# EAGLE design Juggling_Egg_V01 (EAGLE 9.7.0)
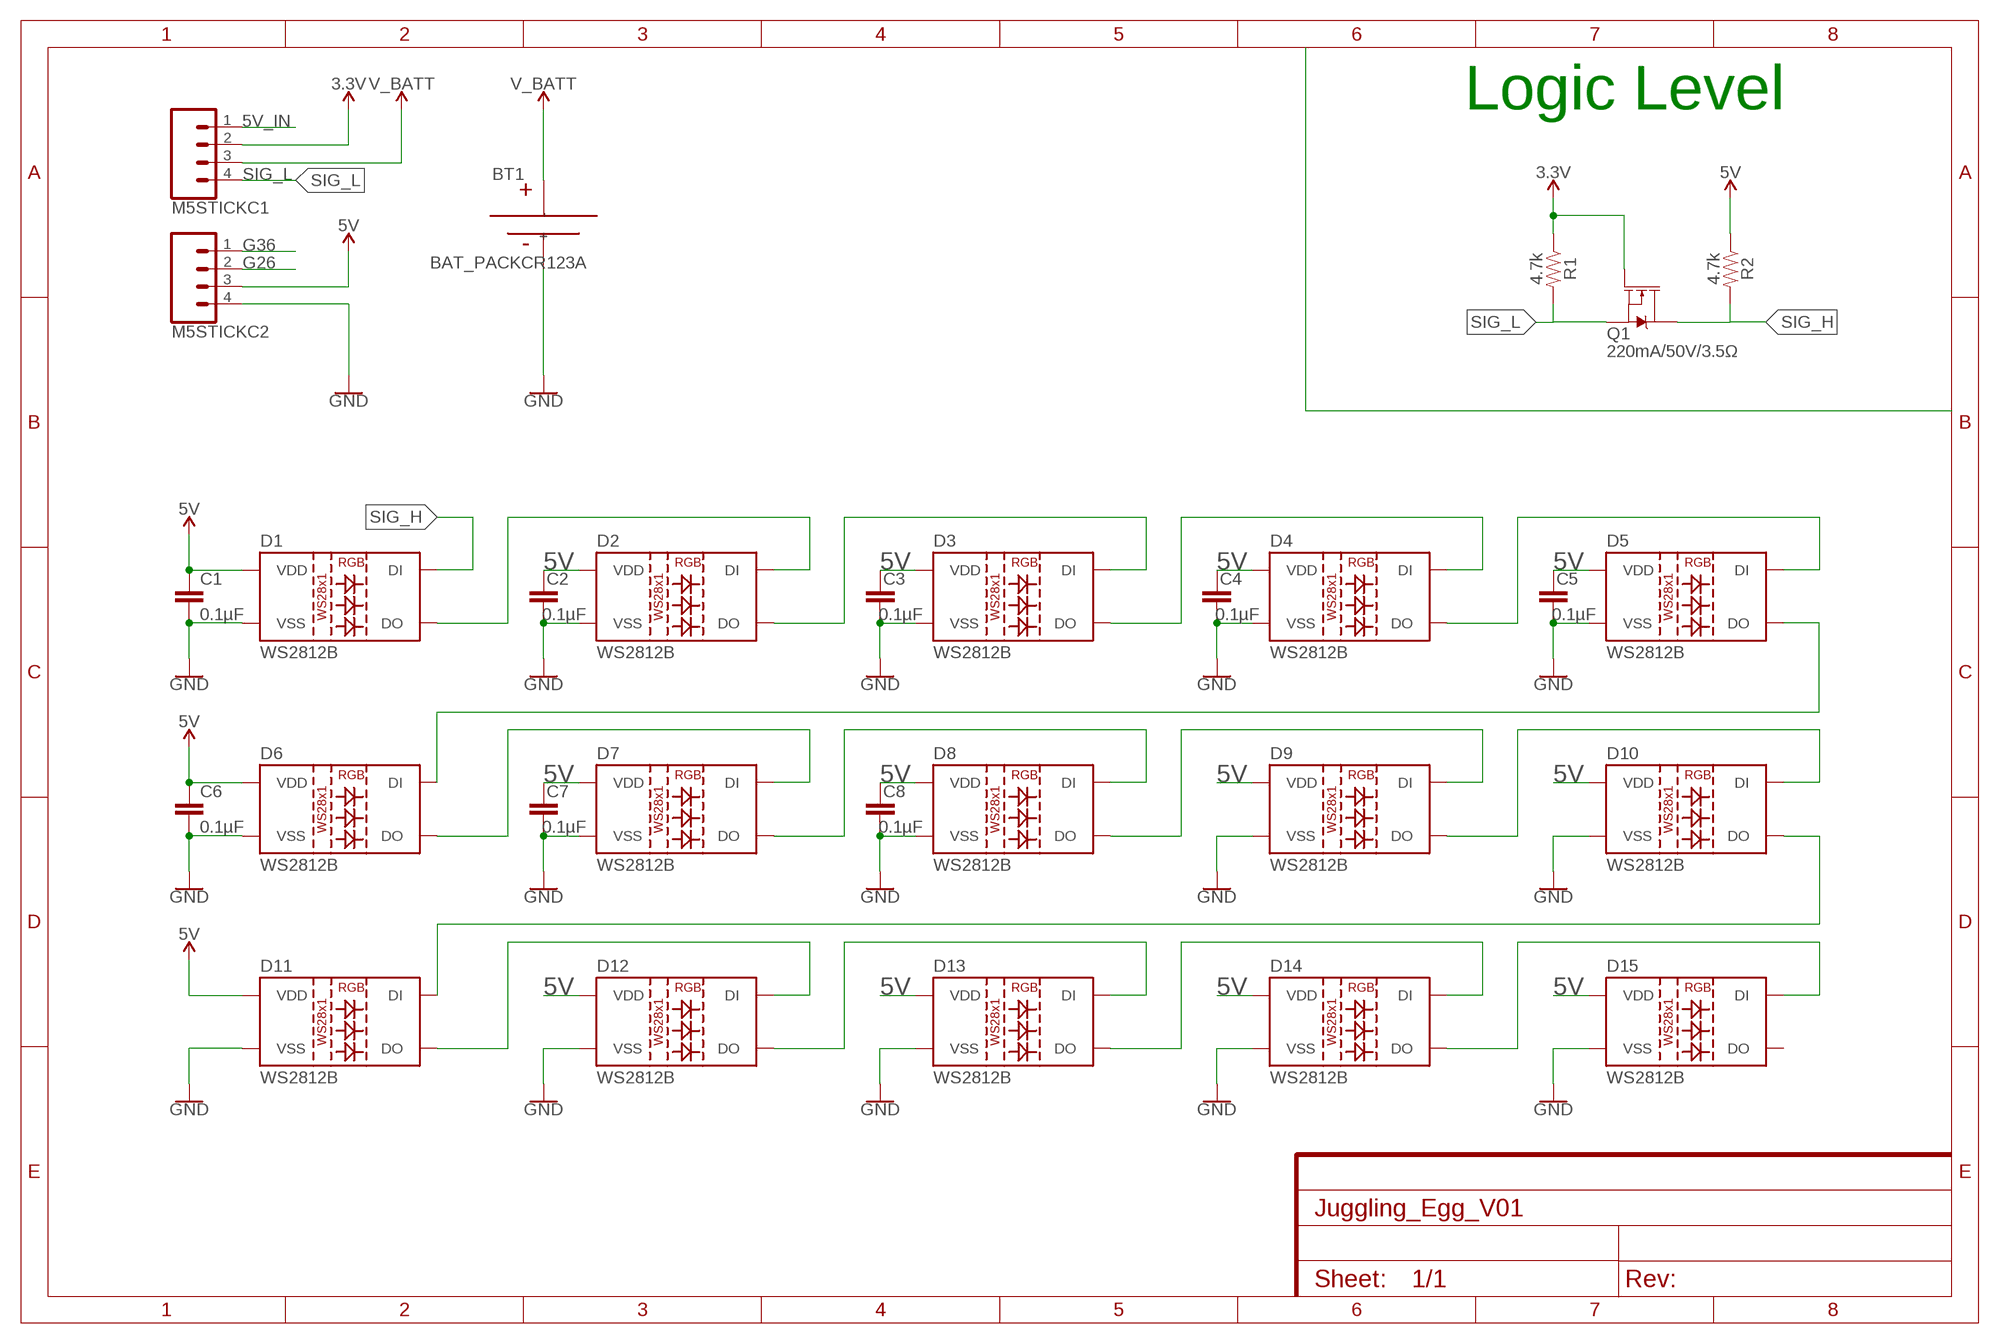
[diagram p0: schematic, sheet 1]

## Parts
BT1  BAT_PACKCR123A  [BH123A]
C1  0.1µF  0.33UF/330NF-0805-50V-10%  [0805]
C2  0.1µF  0.33UF/330NF-0805-50V-10%  [0805]
C3  0.1µF  0.33UF/330NF-0805-50V-10%  [0805]
C4  0.1µF  0.33UF/330NF-0805-50V-10%  [0805]
C5  0.1µF  0.33UF/330NF-0805-50V-10%  [0805]
C6  0.1µF  0.33UF/330NF-0805-50V-10%  [0805]
C7  0.1µF  0.33UF/330NF-0805-50V-10%  [0805]
C8  0.1µF  0.33UF/330NF-0805-50V-10%  [0805]
D1  WS2812B  [WS2812B]
D2  WS2812B  [WS2812B]
D3  WS2812B  [WS2812B]
D4  WS2812B  [WS2812B]
D5  WS2812B  [WS2812B]
D6  WS2812B  [WS2812B]
D7  WS2812B  [WS2812B]
D8  WS2812B  [WS2812B]
D9  WS2812B  [WS2812B]
D10  WS2812B  [WS2812B]
D11  WS2812B  [WS2812B]
D12  WS2812B  [WS2812B]
D13  WS2812B  [WS2812B]
D14  WS2812B  [WS2812B]
D15  WS2812B  [WS2812B]
M5STICKC1  CONN_04SMD  [1X04_SMD_RA_MALE]
M5STICKC2  CONN_04SMD  [1X04_SMD_RA_MALE]
Q1  220mA/50V/3.5Ω  MOSFET-NCH-BSS138  [SOT23-3]
R1  4.7k  RESISTOR0805  [0805]
R2  4.7k  RESISTOR0805  [0805]

## Nets
3.3V: M5STICKC1.2 Q1.1(G) R1.1
5V: C1.1 C2.2 C3.2 C4.2 C5.2 C6.1 C7.2 C8.2 D1.1(VDD) D2.1(VDD) D3.1(VDD) D4.1(VDD) D5.1(VDD) D6.1(VDD) D7.1(VDD) D8.1(VDD) D9.1(VDD) D10.1(VDD) D11.1(VDD) D12.1(VDD) D13.1(VDD) D14.1(VDD) D15.1(VDD) M5STICKC2.3 R2.1
5V_IN: M5STICKC1.1
G26: M5STICKC2.2
G36: M5STICKC2.1
GND: BT1.- C1.2 C2.1 C3.1 C4.1 C5.1 C6.2 C7.1 C8.1 D1.3(VSS) D2.3(VSS) D3.3(VSS) D4.3(VSS) D5.3(VSS) D6.3(VSS) D7.3(VSS) D8.3(VSS) D9.3(VSS) D10.3(VSS) D11.3(VSS) D12.3(VSS) D13.3(VSS) D14.3(VSS) D15.3(VSS) M5STICKC2.4
N$2: D2.2(DO) D3.4(DI)
N$3: D3.2(DO) D4.4(DI)
N$4: D4.2(DO) D5.4(DI)
N$5: D6.2(DO) D7.4(DI)
N$6: D1.2(DO) D2.4(DI)
N$7: D7.2(DO) D8.4(DI)
N$8: D8.2(DO) D9.4(DI)
N$9: D9.2(DO) D10.4(DI)
N$10: D11.2(DO) D12.4(DI)
N$11: D12.2(DO) D13.4(DI)
N$12: D13.2(DO) D14.4(DI)
N$13: D14.2(DO) D15.4(DI)
N$14: D5.2(DO) D6.4(DI)
N$15: D10.2(DO) D11.4(DI)
SIG_H: D1.4(DI) Q1.3(D) R2.2
SIG_L: M5STICKC1.4 Q1.2(S) R1.2
V_BATT: BT1.+ M5STICKC1.3
Unconnected: D15.2(DO)

## Notes on the sheet
- Logic Level

## Library data of the parts
BT1 = batteries:BAT_PACK: collection of battery footprints; DIGIKEY: BH123A-ND; MANUFACTURER: MPD; MPN: BH123A
C1-C8 = SparkFun-Capacitors:0.33UF/330NF: 0.33µF/330nF ceramic capacitors A capacitor is a passive two-terminal electrical component used to store electrical energy temporarily in an electric field.; PROD_ID: CAP-08469; VALUE: 0.33µF
D1-D15 = SparkFun-LED:WS2812B: WS2812B SMD addressable RGB LED 5x5mm SMD LED with built-in controller IC. Color: Red/Green/Blue mC Rating: RGB: 390, 660, 180 mcd Forward Voltage: RGB: 2.0, 3.0, 3.0 V Packages:WS2812B SparkFun Products: Blynk Board - ESP8266 <https://www.sparkfun.com/products/13794>; PROD_ID: DIO-12503
M5STICKC1 M5STICKC2 = SparkFun-Connectors:CONN_04: Multi connection point. Often used as Generic Header-pin footprint for 0.1 inch spaced/style header connections On any of the 0.1 inch spaced packages, you can populate with these: Break Away Headers - Straight <https://www.sparkfun.com/products/116> (PRT-00116) Break Away Male Headers - Right Angle <https://www.sparkfun.com/products/553> (PRT-00553) Female Headers <https://www.sparkfun.com/products/115> (PRT-00115) Break Away Headers - Machine Pin <https://www.sparkfun.com/products/117> (PRT-00117) Break Away Female Headers - Swiss Machine Pin <https://www.sparkfun.com/products/743> (PRT-00743) For SCREWTERMINALS and SPRING TERMINALS visit here: Screw Terimnals on SparkFun.com <https://www.sparkfun.com/search/results?term=Screw+Terminals> (5mm/3.5mm/2.54mm spacing) This device is also useful as a general connection point to wire up your design to another part of your project. Our various solder wires solder well into these plated through hole pads. Hook-Up Wire - Assortment (Stranded, 22 AWG) <https://www.sparkfun.com/products/11375> (PRT-11375) Hook-Up Wire - Assortment (Solid Core, 22 AWG) <https://www.sparkfun.com/products/11367> (PRT-11367) View the entire wire category on our website here <https://www.sparkfun.com/categories/141> Special notes: Molex polarized connector foot print use with SKU : PRT-08231 with associated crimp pins and housings. 1MM SMD Version SKU: PRT-10208; PROD_ID: CONN-09140; SF_ID: PRT-12638
Q1 = SparkFun-DiscreteSemi:MOSFET-NCH: N-channel MOSFETs Voltage controlled devices that allow control of high current outputs. SparkFun Products: SparkFun OpenScale <https://www.sparkfun.com/products/13261> SparkFun Digital Sandbox <https://www.sparkfun.com/products/12651> SparkFun Monster Moto Shield <https://www.sparkfun.com/products/10182> SparkFun MOSFET Power Controller <https://www.sparkfun.com/products/11214>; PROD_ID: TRANS-00830
R1 R2 = SparkFun-Resistors:RESISTOR: Generic Resistor Package

## Board
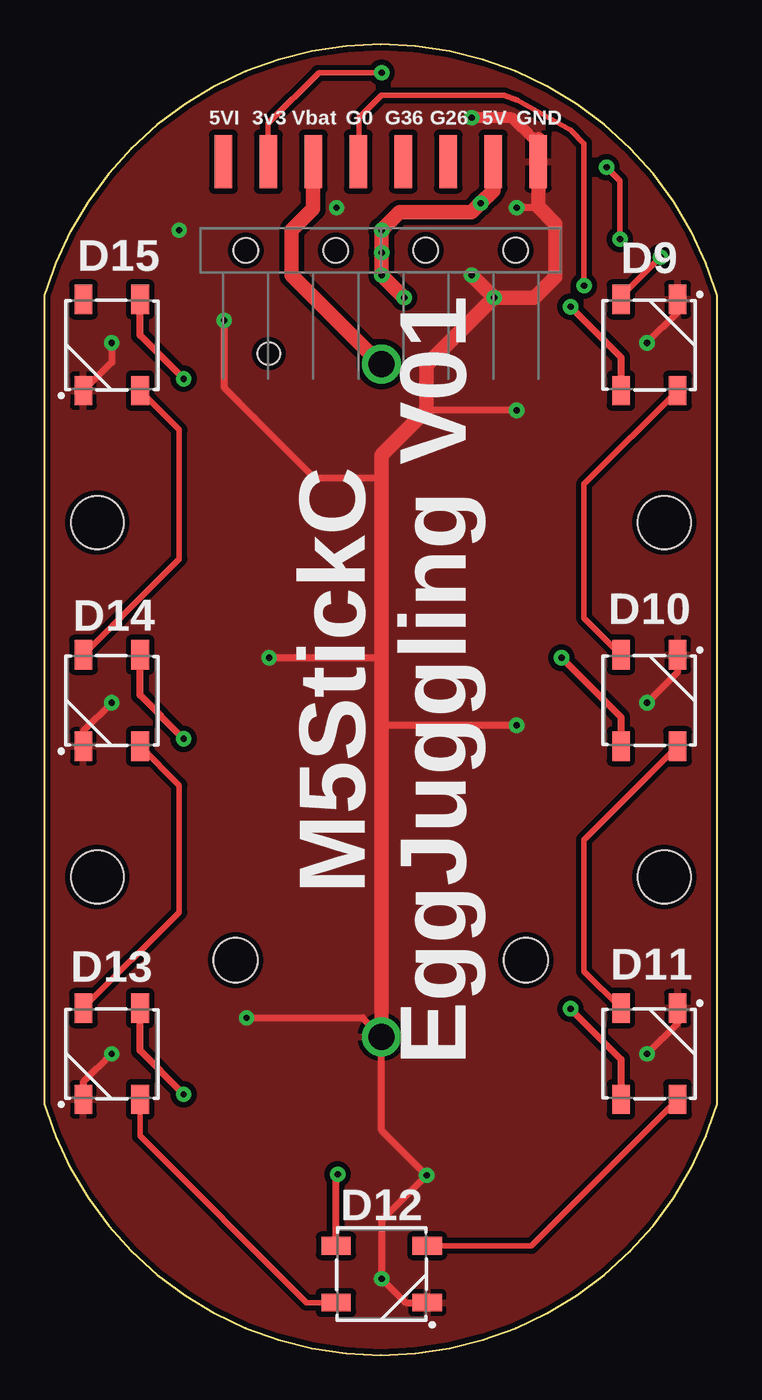
[diagram p1: board, top side]
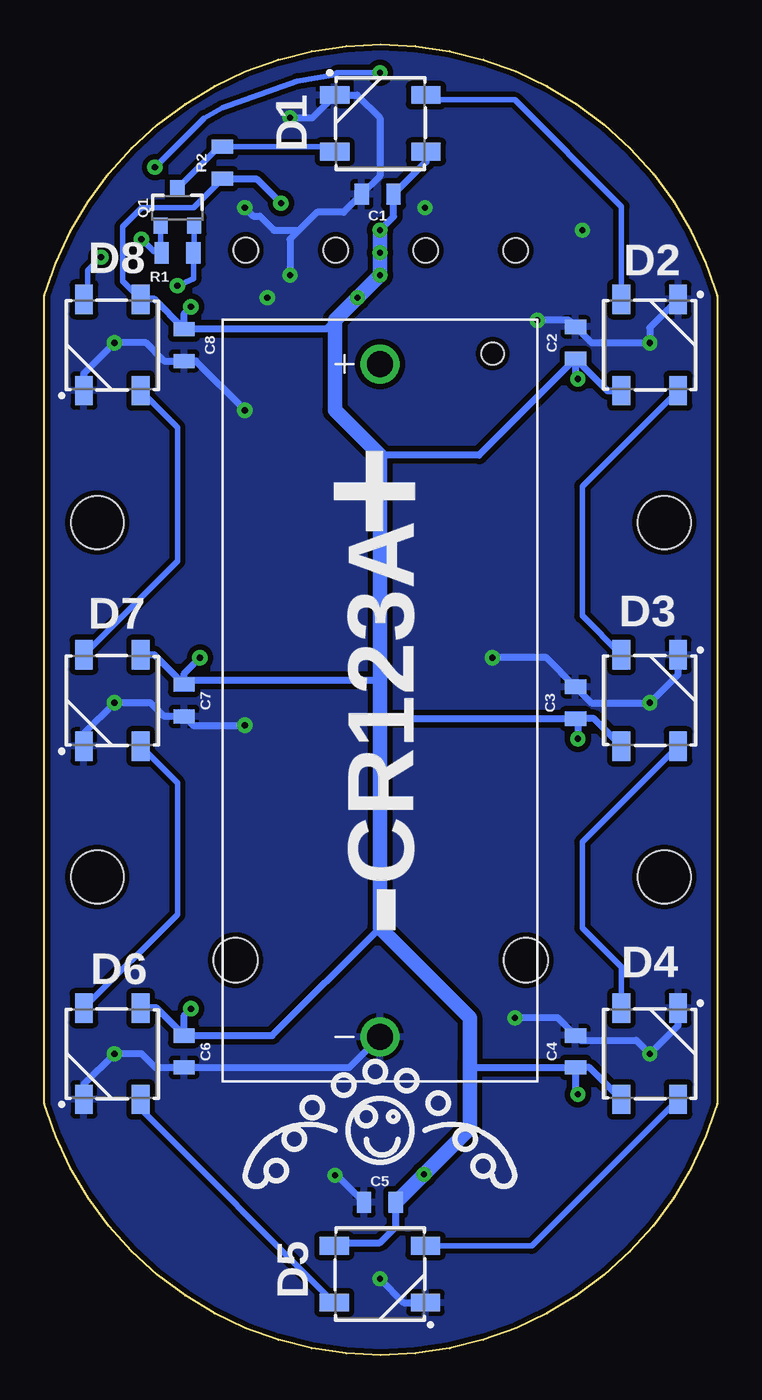
[diagram p2: board, bottom side, seen from below]

Size 38 x 74 mm. Coordinates in mm from the lower left corner, seen from the top.
Outline: 0,59.8 0,14.19 arc147 38,14.19 38,59.8 arc147 0,59.8
Copper layers (1*16): Top 0.035mm / dielectric 1.5mm / Bottom 0.035mm
Design rules "SparkFun-2-layer-STANDARD *": minimum track width 10mil, minimum drill 10mil, track to track 10mil, track to pad 8mil, pad to pad 8mil, via to via 10mil, smd to smd 8mil, copper to edge 8mil, drill to drill 8mil, minimum pad ring 10mil, minimum via ring 10mil, stop-mask expansion 4mil, vias tented up to drill 25mil, thermal gap 10mil
Holes 3 mm at 3,47 3,27 35,27 35,47
Holes 2.5 mm at 10.8,22.3 27.2,22.3

### Footprints (pad centres in the part's own frame; a part is rotated, then mirrored left to right if it is on the bottom)
BH123A = drill 1.47: + 18.985,0; - -18.985,0 | hole 1.27: 19.58,-6.37
0805 = smd 0.8 x 1.2: 1 -0.9,0; 2 0.9,0
WS2812B = smd 1.651 x 1: 1 2.577,-1.6; 2 2.577,1.6; 3 -2.577,1.6; 4 -2.577,-1.6
1X04_SMD_RA_MALE = smd 1 x 3: 1 -3.81,5; 2 -1.27,5; 3 1.27,5; 4 3.81,5 | hole 1.4: -2.54,0; 2.54,0
SOT23-3 = smd 0.8 x 0.9: 1 -0.95,-1; 2 0.95,-1; 3 0,1.1

### Placement (x,y rotation side)
BT1  19.05,36.96 90 bottom
C1  19.18,65.53 180 bottom
C2  8,57.15 270 bottom
C3  8,36.83 270 bottom
C4  8,17.14 270 bottom
C5  19.05,8.64 0 bottom
C6  30.1,17.14 270 bottom
C7  30.1,36.96 90 bottom
C8  30.1,57.02 90 bottom
D1  19.02,69.53 0 bottom
D2  3.81,57.02 270 bottom
D3  3.81,36.96 270 bottom
D4  3.81,17.02 270 bottom
D5  19.05,4.57 180 bottom
D6  34.16,17.02 90 bottom
D7  34.16,36.96 90 bottom
D8  34.16,57.02 90 bottom
D9  34.16,57.02 270 top
D10  34.16,36.96 270 top
D11  34.16,17.02 270 top
D12  19.05,4.57 180 top
D13  3.81,17.02 90 top
D14  3.81,36.96 90 top
D15  3.81,57.02 90 top
M5STICKC1  13.92,62.37 0 top
M5STICKC2  24.08,62.38 0 top
Q1  30.48,64.77 0 bottom
R1  30.48,62.23 0 bottom
R2  27.94,67.31 90 bottom

### Tracks (layer width: path | path; a pad name or v marks a point on that pad's centre or on a via)
3.3V  (via drill 0.35)
  Top 0.305: v31.75,67.06 32.51,66.29 v32.51,62.99 | M5STICKC1.2 12.65,69.55 15.48,72.38 15.54,72.39 v19.05,72.39
  Bottom 0.305: v31.75,67.06 28.98,69.83 27.94,70.42 23.72,71.92 21.57,72.29 21.47,72.39 v19.05,72.39 | 31.43,62.28 Q1.1 | R1.1 31.43,62.28 | v32.51,62.99 31.8,62.28 31.43,62.28
5V  (via drill 0.35)
  Top 0.406: D12.1 16.47,10.12 v16.57,10.22 | v7.87,55.12 5.41,57.58 D15.1 | v7.87,34.8 5.41,37.26 D14.1 | v7.87,14.73 5.41,17.2 D13.1 | v29.72,19.56 32.56,16.71 D11.1 | v29.21,39.37 32.56,36.02 D10.1 | v29.72,59.18 32.56,56.34 D9.1
  Top 0.813: v20.32,59.69 v19.05,60.96 v19.05,62.23 v19.05,63.5 20.07,64.52 24.13,64.52 v24.64,65.02 25.35,65.74 M5STICKC2.3
  Bottom 0.305: R2.1 29.58,64.77 32.51,64.77 33.58,63.7 33.58,60.62 D8.1
  Bottom 0.406: 19.05,38.1 29.86,38.1 C7.2 | C3.2 18.68,35.93 19.05,35.56 | 21.59,58.42 22.09,57.92 C8.2 | 13.97,16.51 13.71,16.24 C4.2 | C6.1 25.14,18.04 19.05,24.13 | C2.2 13.45,50.8 19.05,50.8 | C2.2 6.2,54.45 D2.1 | C8.2 31.78,59.6 D8.1 | C7.2 31.78,39.53 D7.1 | C6.1 31.65,19.59 D6.1 | D5.1 21.45,6.35 19.05,6.35 18.15,7.25 C5.2 | D4.1 7.21,16.24 C4.2 | D3.1 6.96,35.93 C3.2 | D1.1 16.45,67.36 C1.1 18.28,64.27 v19.05,63.5 | C2.2 8,55.24 v7.87,55.12 | C3.2 7.87,35.8 v7.87,34.8 | C4.2 8,14.86 v7.87,14.73 | C6.1 30.1,19.18 v29.72,19.56 | C7.2 30.1,38.48 v29.21,39.37 | C8.2 30.1,58.8 v29.72,59.18 | R2.1 26.02,66.41 v24.64,65.02
  Bottom 0.813: C5.2 v16.57,10.22 13.97,12.82 13.97,16.51 13.97,19.05 19.05,24.13 19.05,35.56 19.05,38.1 19.05,50.8 21.59,53.34 21.59,58.42 v20.32,59.69 v19.05,60.96 v19.05,62.23 v19.05,63.5
GND  (via drill 0.35)
  Top 0.406: v3.81,57.15 3.81,56.05 D15.3 | v3.81,36.83 2.21,35.23 D14.3 | v3.81,17.02 2.21,15.42 D13.3 | D12.3 20.4,2.97 v19.05,4.32 19.05,7.62 v21.59,10.16 19.05,12.7 BT1.- 17.97,19.05 v11.43,19.05 | v34.04,17.02 35.76,18.74 D11.3 | v34.04,36.83 35.76,38.56 D10.3 | v34.04,57.15 35.76,58.88 D9.3 | v12.7,39.37 19.05,39.37 | v26.67,35.56 19.05,35.56 | v26.67,53.34 21.59,53.34 | v10.16,58.42 10.16,54.61 15.24,49.53 19.05,49.53 | 27.89,64.82 27.84,64.77 v26.67,64.77
  Top 0.61: v24.13,69.85 26.42,69.85 27.64,68.63 27.89,68.63
  Top 0.813: v25.4,59.69 21.59,55.88 21.59,53.34 19.05,50.8 19.05,49.53 19.05,39.37 19.05,35.56 BT1.- | 27.89,68.63 M5STICKC2.4 27.89,64.82 28.85,63.86 28.85,60.88 27.66,59.69 v25.4,59.69 | v25.4,59.69 v24.13,60.96
  Bottom 0.406: v24.13,69.85 22.86,69.85 21.58,71.13 D1.3 20.33,71.13 19.05,69.85 19.05,66.56 C1.2 21.09,64.52 22.61,64.52 23.62,63.5 | 23.62,63.5 24.13,62.99 v24.13,60.96 | D2.3 3.81,58 v3.81,57.15 7.1,57.15 C2.1 8.37,58.42 v10.16,58.42 | D3.3 2.21,38.43 v3.81,36.83 7.1,36.83 C3.1 9.64,39.37 v12.7,39.37 | D4.3 2.21,18.62 v3.81,17.02 4.57,17.78 7.74,17.78 C4.1 9.01,19.05 v11.43,19.05 | C5.1 21.47,10.16 v21.59,10.16 | v19.05,4.32 17.7,2.97 D5.3 | D6.3 35.76,15.29 v34.04,17.02 32.51,17.02 31.74,16.24 C6.2 20.78,16.24 BT1.- | D7.3 35.76,35.1 v34.04,36.83 32,36.83 31.23,36.06 C7.1 29.6,35.56 v26.67,35.56 | D8.3 35.76,55.42 v34.04,57.15 32.26,57.15 31.23,56.12 C8.1 29.45,56.12 v26.67,53.34 | v26.67,64.77 26.2,64.3 25.82,64.3 25.03,63.5 23.62,63.5
  other vias: 16.51,64.77 7.62,63.5
  pour Bottom (isolate 0.305): 0.2,0.2 37.9,0.2 37.9,73.46 0.2,73.46
  pour Top (isolate 0.305): 0.2,0.2 37.9,0.2 37.9,73.46 0.2,73.46
N$2
  Bottom 0.305: D2.2 7.62,49.04 7.62,41.74 D3.4
N$3
  Bottom 0.305: D3.2 7.62,28.97 7.62,24.13 5.41,21.92 D4.4
N$4
  Bottom 0.305: D4.2 10.48,6.17 D5.4
N$5
  Bottom 0.305: D6.2 30.48,24.88 30.48,32.3 D7.4
N$6
  Bottom 0.305: D2.4 5.41,64.85 11.43,70.87 16.18,70.87 D1.2
N$7
  Bottom 0.305: D7.2 30.48,44.82 30.48,52.36 D8.4
N$8  (via drill 0.35)
  Top 0.305: v34.8,61.98 32.56,59.74 D9.4
  Bottom 0.305: D8.2 35.56,59.8 35.56,61.21 v34.8,61.98
N$9
  Top 0.305: D9.2 30.48,49.16 30.48,41.62 D10.4
N$10
  Top 0.305: D11.2 27.49,6.17 D12.4
N$11
  Top 0.305: D12.2 14.81,2.97 5.41,12.37 D13.4
N$12
  Top 0.305: D13.2 7.62,25 7.62,32.17 D14.4
N$13
  Top 0.305: D14.2 7.62,44.94 7.62,52.24 D15.4
N$14
  Bottom 0.305: D5.2 32.56,13.91 D6.4
N$15
  Top 0.305: D10.2 30.48,29.1 30.48,21.68 D11.4
SIG_H
  Bottom 0.305: Q1.3 28.14,68.21 R2.2 21.88,68.21 D1.4
SIG_L  (via drill 0.35)
  Top 0.305: M5STICKC1.4 17.78,67.42 17.78,69.85 19.05,71.12 25.96,71.12 26.71,70.85 29.73,69.15 30.48,68.4 v30.48,60.37
  Bottom 0.305: Q1.2 29.53,62.28 R1.2 29.58,60.76 v30.48,60.37
V_BATT
  Top 0.813: M5STICKC1.3 15.19,64.72 13.97,63.5 13.97,60.96 18.99,55.94 BT1.+

### Text on the board
tNames: 5VI | 3v3 | Vbat | G0 | G36 | G26 | 5V | GND | M5StickC / EggJuggling V01
bNames: + | CR123A | -